# EAGLE design untitled (EAGLE 9.6.2)
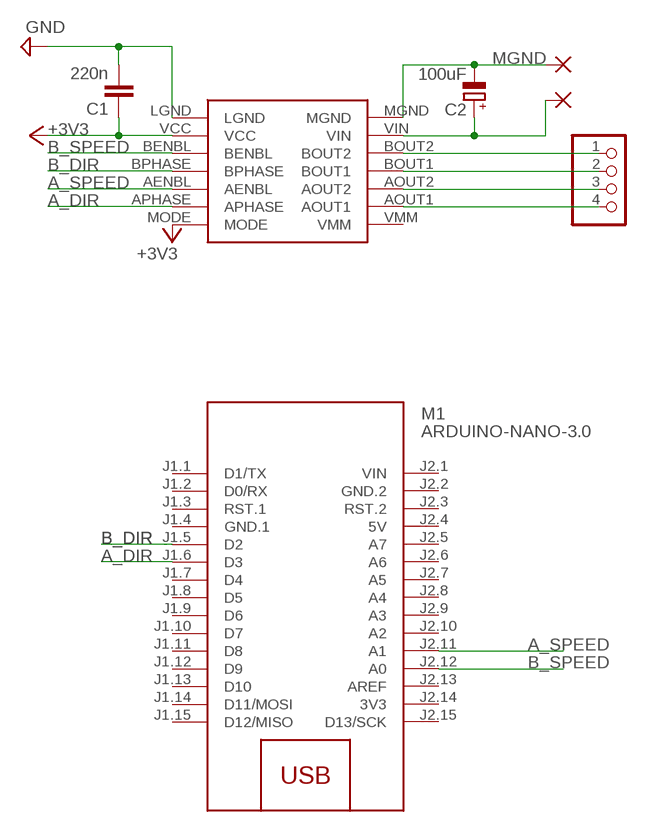
[diagram p0: schematic, sheet 1]

## Parts
C1  220n  C-EU025-025X050  [C025-025X050]
C2  100uF  CPOL-EUE3.5-8  [E3,5-8]
GND  WIREPADSMD5-1,8  [5-1,8]
JP1  PINHD-1X4  [1X04]
M1  ARDUINO-NANO-3.0  [ARDUINO-NANO-3.0]
U$1  POLOLU_MOTOR_DRV8835THROUGHHOLE  [POLOLU_MOTOR_DRV_DRV8835]
VIN_BAT  WIREPADSMD5-1,8  [5-1,8]

## Nets
+3V3: C1.1 U$1.MODE U$1.VCC
A_DIR: M1.J1.6(D3) U$1.APHASE
A_SPEED: M1.J2.11(A1) U$1.AENBL
B_DIR: M1.J1.5(D2) U$1.BPHASE
B_SPEED: M1.J2.12(A0) U$1.BENBL
GND: C1.2 U$1.LGND
MGND: C2.- GND.1(P) U$1.MGND
N$1: C2.+ U$1.VIN VIN_BAT.1(P)
N$3: JP1.1 U$1.BOUT2
N$4: JP1.2 U$1.BOUT1
N$5: JP1.3 U$1.AOUT2
N$6: JP1.4 U$1.AOUT1
Unconnected: M1.J1.1(D1/TX) M1.J1.2(D0/RX) M1.J1.3(RST.1) M1.J1.7(D4) M1.J1.8(D5) M1.J1.9(D6) M1.J1.10(D7) M1.J1.11(D8) M1.J1.12(D9) M1.J1.13(D10) M1.J1.14(D11/MOSI) M1.J1.15(D12/MISO) M1.J2.3(RST.2) M1.J2.5(A7) M1.J2.6(A6) M1.J2.7(A5) M1.J2.8(A4) M1.J2.9(A3) M1.J2.10(A2) M1.J2.13(AREF) M1.J2.15(D13/SCK) U$1.VMM

## Power pins joined to a net without a drawn wire
3V3: M1.J2.14(3V3)
5V: M1.J2.4(5V)
GND.1: M1.J1.4(GND.1)
GND.2: M1.J2.2(GND.2)
VIN: M1.J2.1(VIN)

## Library data of the parts
C1 = rcl:C-EU: CAPACITOR, European symbol; SPICEPREFIX: C
C2 = rcl:CPOL-EU: POLARIZED CAPACITOR, European symbol; SPICEPREFIX: C
GND VIN_BAT = wirepad:WIREPAD: Wire PAD connect wire on PCB
JP1 = pinhead:PINHD-1X4: PIN HEADER
M1 = diy-modules:ARDUINO-NANO-3.0: Arduino Nano 3.0 and compatible devices More details available here: https://www.arduino.cc/en/Main/ArduinoBoardNano Click here to find device on ebay.com <http://www.ebay.com/sch/arduino+nano>
U$1 = DRV8835:POLOLU_MOTOR_DRV8835

## Board
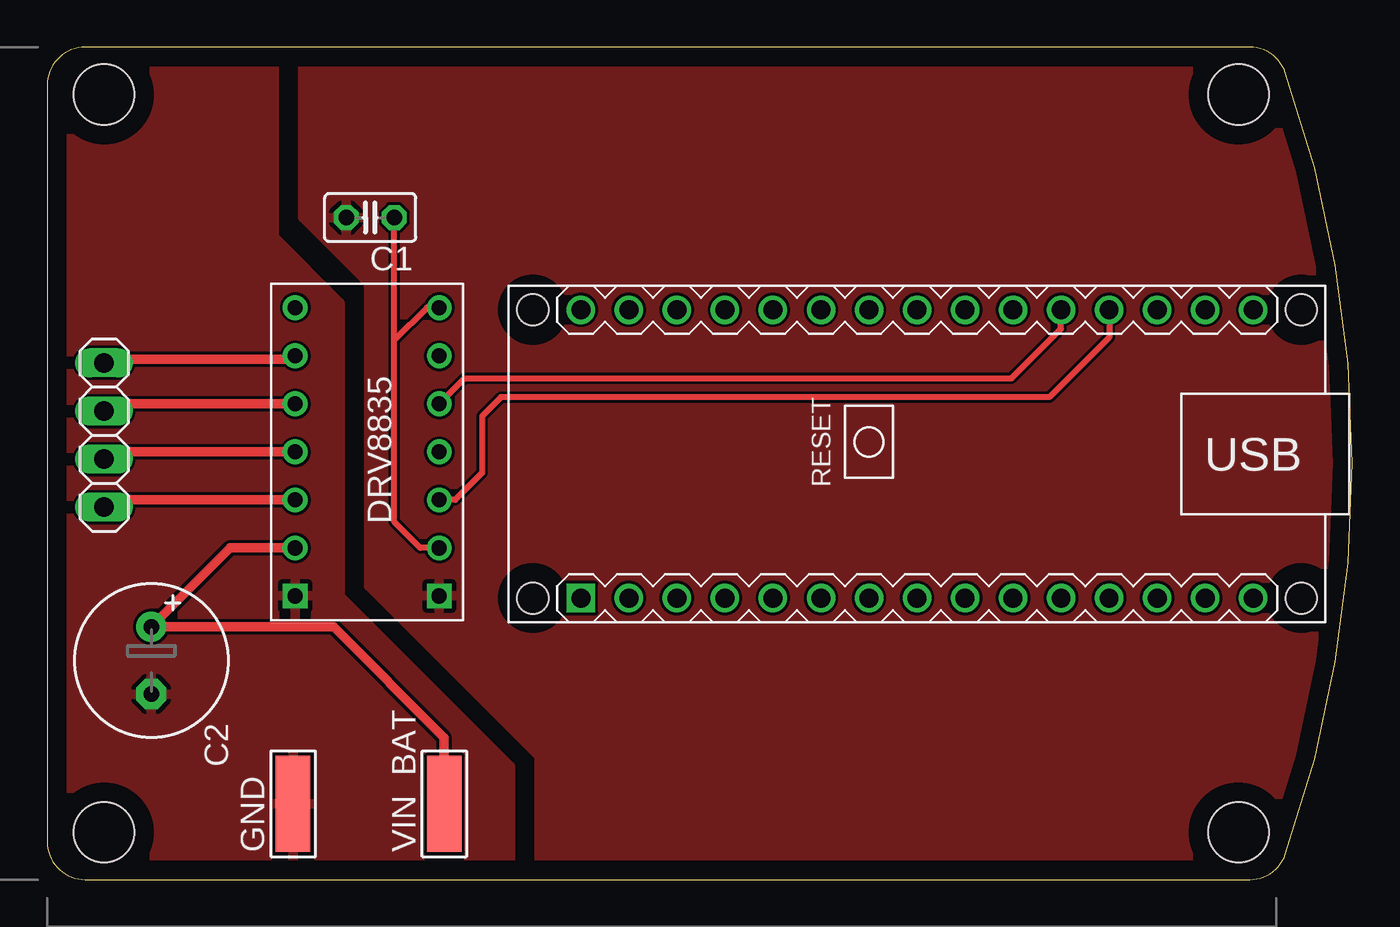
[diagram p1: board, top side]
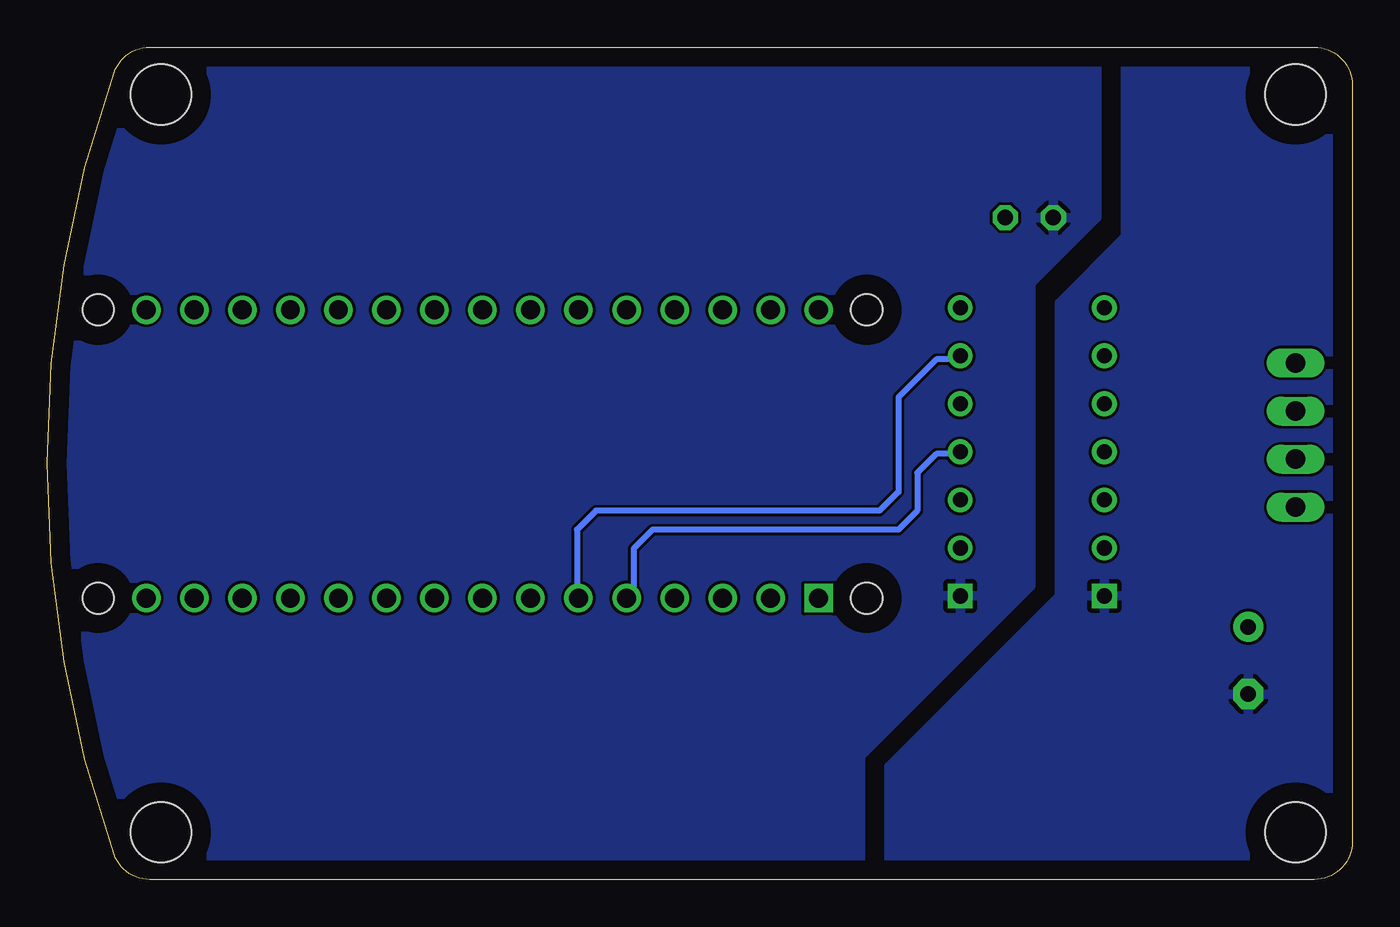
[diagram p2: board, bottom side, seen from below]

Size 69.02 x 44 mm. Coordinates in mm from the lower left corner, seen from the top.
Outline: 65.49,42.66 arc71 63.6,44 2,44 arc90 0,42 0,2 arc90 2,0 63.6,0 arc71 65.49,1.34 arc39 65.49,42.66
Copper layers (1*16): Top 0.035mm / dielectric 1.5mm / Bottom 0.035mm
Design rules "default": minimum track width 6mil, minimum drill 0.35mm, track to track 6mil, track to pad 6mil, pad to pad 6mil, via to via 6mil, smd to smd 6mil, copper to edge 40mil, drill to drill 6mil, minimum pad ring 10mil, minimum via ring 8mil, stop-mask expansion 4mil, vias tented up to drill 0mil, thermal gap 10mil
Holes 3.2 mm at 63,41.5 3,41.5 3,2.5 63,2.5

### Footprints (pad centres in the part's own frame; a part is rotated, then mirrored left to right if it is on the bottom)
C025-025X050 = drill 0.813 octagon: 1 -1.27,0; 2 1.27,0
E3,5-8 = drill 0.813 pad 1.6: + -1.778,0 | drill 0.813 pad 1.6 octagon: - 1.778,0
5-1,8 = smd 1.829 x 5.08: 1 0,0
1X04 = drill 1.016 long: 1 -3.81,0; 2 -1.27,0; 3 1.27,0; 4 3.81,0
ARDUINO-NANO-3.0 = drill 1 square: J1.1 17.78,7.62 | drill 1: J1.2 15.24,7.62; J1.3 12.7,7.62; J1.4 10.16,7.62; J1.5 7.62,7.62; J1.6 5.08,7.62; J1.7 2.54,7.62; J1.8 0,7.62; J1.9 -2.54,7.62; J1.10 -5.08,7.62; J1.11 -7.62,7.62; J1.12 -10.16,7.62; J1.13 -12.7,7.62; J1.14 -15.24,7.62; J1.15 -17.78,7.62; J2.1 17.78,-7.62; J2.2 15.24,-7.62; J2.3 12.7,-7.62; J2.4 10.16,-7.62; J2.5 7.62,-7.62; J2.6 5.08,-7.62; J2.7 2.54,-7.62; J2.8 0,-7.62; J2.9 -2.54,-7.62; J2.10 -5.08,-7.62; J2.11 -7.62,-7.62; J2.12 -10.16,-7.62; J2.13 -12.7,-7.62; J2.14 -15.24,-7.62; J2.15 -17.78,-7.62 | hole 1.651: -20.32,7.62; -20.32,-7.62; 20.32,-7.62; 20.32,7.62
POLOLU_MOTOR_DRV_DRV8835 = drill 0.8: AENBL 1.27,6.35; AOUT1 8.89,3.81; AOUT2 8.89,6.35; APHASE 1.27,3.81; BENBL 1.27,11.43; BOUT1 8.89,8.89; BOUT2 8.89,11.43; BPHASE 1.27,8.89; MODE 1.27,1.27; VCC 1.27,13.97; VIN 8.89,13.97; VMM 8.89,1.27 | drill 0.8 square: LGND 1.27,16.51; MGND 8.89,16.51

### Placement (x,y rotation side)
C1  17.08,35 180 top
C2  5.5,11.58 270 top
GND  13,4 0 top
JP1  3,23.5 90 top
M1  46,22.5 180 top
U$1  22,31.5 180 top
VIN_BAT  21,4 0 top

### Tracks (layer width: path | path; a pad name or v marks a point on that pad's centre or on a via)
+3V3
  Top 0.305: U$1.VCC 19.73,17.53 18.35,18.91 18.35,28.5 | 18.35,28.5 C1.1 | 18.35,28.5 20.08,30.23 U$1.MODE
A_DIR
  Bottom 0.305: U$1.APHASE 20.92,27.5 22,27.5 24,25.5 24,20.5 25,19.5 40,19.5 41,18.5 41,14.96 M1.J1.6
A_SPEED
  Top 0.305: U$1.AENBL 22.08,26.5 51,26.5 53.62,29.12 M1.J2.11
B_DIR
  Bottom 0.305: U$1.BPHASE 20.84,22.5 22,22.5 23,21.5 23,19.5 24,18.5 37,18.5 38,17.5 38,15.26 M1.J1.5
B_SPEED
  Top 0.305: M1.J2.12 56.16,28.66 53,25.5 24,25.5 23,24.5 23,21.5 21.57,20.07 U$1.BENBL
GND
  pour Top: 13.5,45 13.5,35 17,31.5 17,15.5 26,6.5 26,-2.5 73,-2.5 73,45
  pour Bottom: 13.5,45 73,45 73,0 26,0 26,6.5 17,15.5 17,31.5 13.5,35
MGND
  pour Top: 0,44 12,44 12,34 15.5,30.5 15.5,15 24.5,6 24.5,0 0,0
  pour Bottom: 0,44 12,44 12,34 15.5,30.5 15.5,15 24.5,6 24.5,5.5 24.5,0 0,0
N$1
  Top 0.508: U$1.VIN 9.67,17.53 C2.+ 15.14,13.36 21,7.5 VIN_BAT.1
N$3
  Top 0.508: U$1.BOUT2 3.38,20.07 JP1.1
N$4
  Top 0.508: U$1.BOUT1 3.38,22.61 JP1.2
N$5
  Top 0.508: U$1.AOUT2 3.38,25.15 JP1.3
N$6
  Top 0.508: U$1.AOUT1 12.92,27.5 3.19,27.5 JP1.4

### Text on the board
tDocu: MOTA | MOTA | MOTB | MOTB